# Altium project DC_Spannungsmessung.PrjPcb
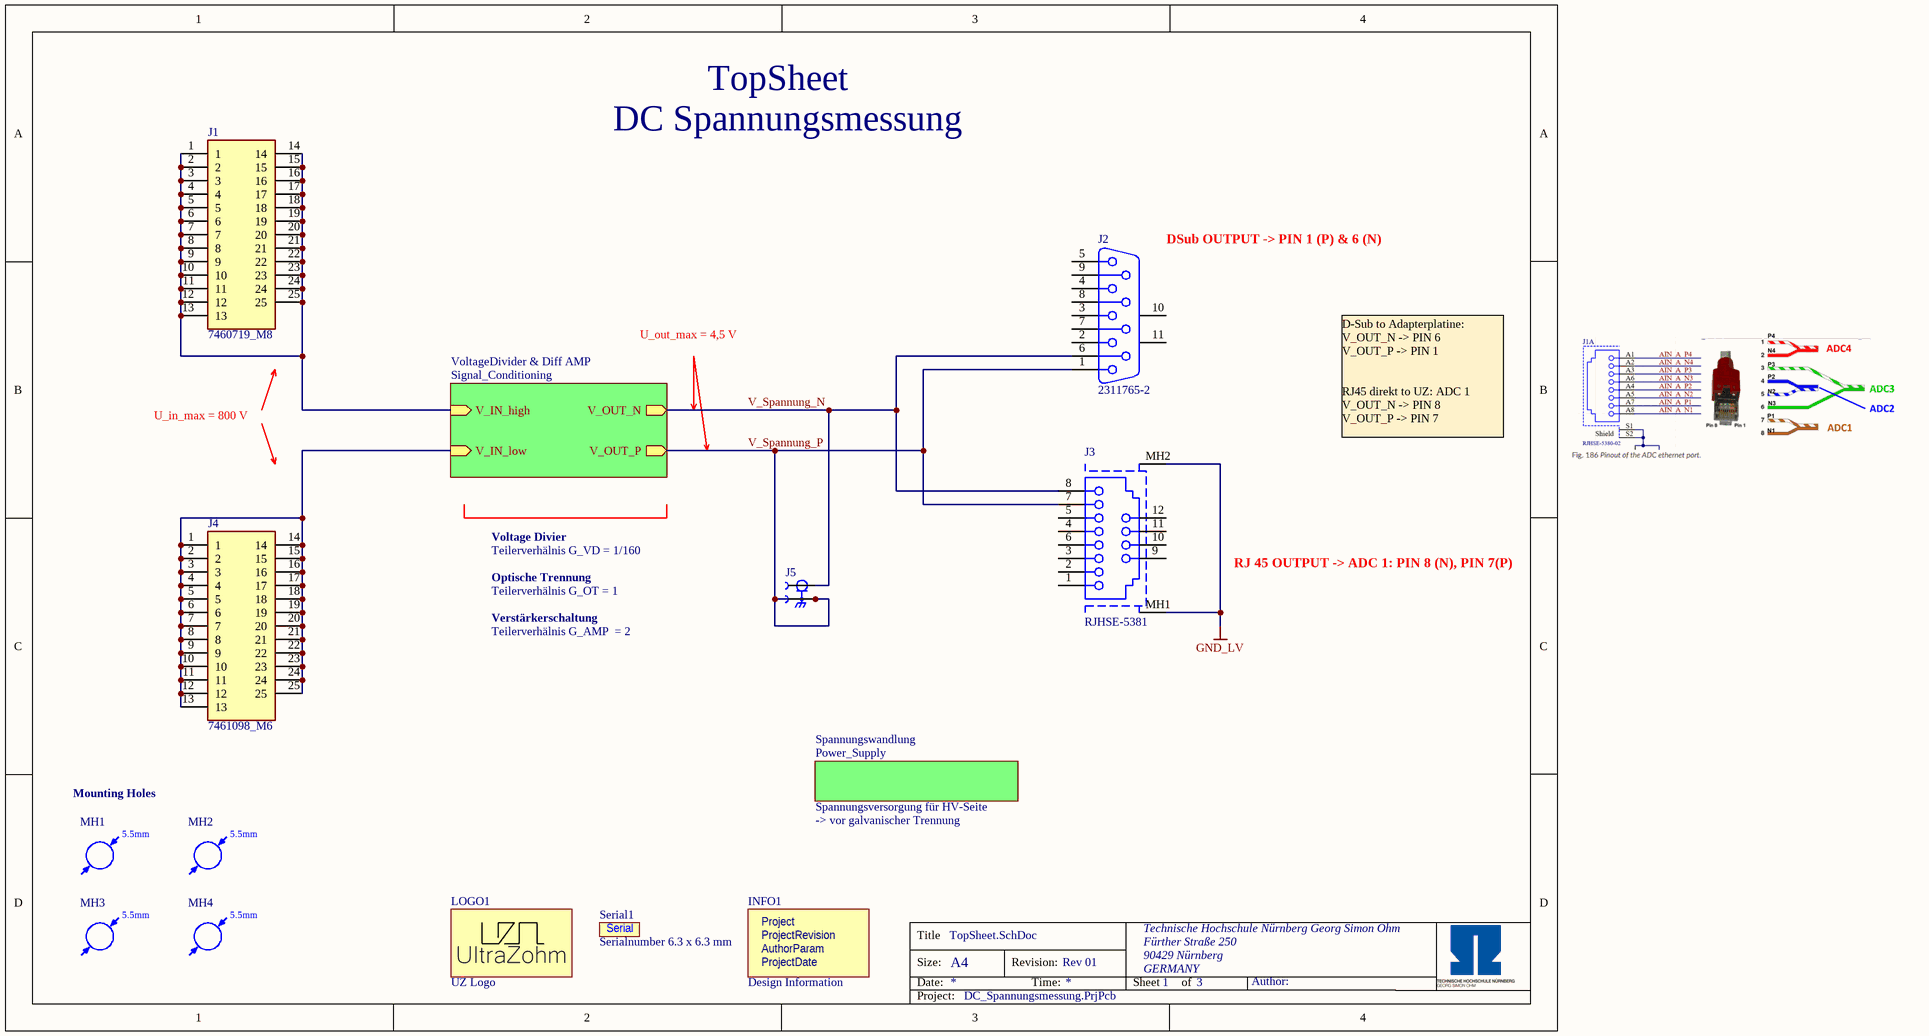
[diagram p0: TopSheet.SchDoc]
AuthorParam: T.Gaupp; Project: DC_Spannungsmessung; ProjectDate: 03/2024; ProjectRevision: Rev 01
3 sheets, 52 parts. Net scope: hierarchical (ports join the sheet entries above them; power ports are global).
Board file: PCB_DC_Spannungsmessung.PcbDoc
Sheets:
  TopSheet.SchDoc
    VoltageDivider & Diff AMP = Signal_Conditioning.SchDoc
  Power_Supply_HV.SchDoc

## Sheet TopSheet.SchDoc
size A4; Website: www.ultrazohm.com; Author: T.Gaupp; CompanyName: Technische Hochschule Nürnberg Georg Simon Ohm; Address1: Fürther Straße 250; Address2: 90429 Nürnberg; Address3: GERMANY; SheetNumber: 1; SheetTotal: 3; CompanyName2: Institut ELSYS

### Parts
INFO1  Design Information  [Design_info]  (no BOM)
J1  7460719_M8  [7460719]
J2  2311765-2  [2311765-2]
J3  RJHSE-5381  [RJHSE-5381]
J4  7461098_M6  [7461098]
J5  BNC5-J-P-GN-ST-TH2D_new  [BNC5-J-P-GN-ST-TH2D_new]  (value not drawn)
LOGO1  UZ Logo  [UZ_Logo_small]  (no BOM)
MH1  Mounting_Hole_M5  [Mounting Hole (M5)]  (value not drawn)
MH2  Mounting_Hole_M5  [Mounting Hole (M5)]  (value not drawn)
MH3  Mounting_Hole_M5  [Mounting Hole (M5)]  (value not drawn)
MH4  Mounting_Hole_M5  [Mounting Hole (M5)]  (value not drawn)
Serial1  Serialnumber 6.3 x 6.3 mm  [SERIAL_6.3X6.3MM]  (no BOM)

### Sub-sheets
Spannungswandlung = Power_Supply (file not in this document): no entries
VoltageDivider & Diff AMP = Signal_Conditioning: V_IN_high (in), V_IN_low (in), V_OUT_N (out), V_OUT_P (out)

### Nets
GND_HV: J4.1 J4.2 J4.3 J4.4 J4.5 J4.6 J4.7 J4.8 J4.9 J4.10 J4.11 J4.12 J4.13 J4.14 J4.15 J4.16 J4.17 J4.18 J4.19 J4.20 J4.21 J4.22 J4.23 J4.24 J4.25 ; sheet VoltageDivider & Diff AMP/V_IN_low
GND_LV: J3.MH1(Shell) J3.MH2(Shell)
V_Spannung_N: J2.6 J3.8 J5.1 ; sheet VoltageDivider & Diff AMP/V_OUT_N  [project net V_OUT_N]
V_Spannung_P: J2.1 J3.7 J5.S_1 J5.S_2 J5.S_3 ; sheet VoltageDivider & Diff AMP/V_OUT_P  [project net V_OUT_P]
NetJ1_1: J1.1 J1.2 J1.3 J1.4 J1.5 J1.6 J1.7 J1.8 J1.9 J1.10 J1.11 J1.12 J1.13 J1.14 J1.15 J1.16 J1.17 J1.18 J1.19 J1.20 J1.21 J1.22 J1.23 J1.24 J1.25 ; sheet VoltageDivider & Diff AMP/V_IN_high

Not connected (* = marked no-connect by the designer): J2 2 3 4 5 7 8 9 10(MH1) 11(MH2); J3 1 2 3 4 5 6 9(8) 10(8) 11(8) 12(8)

### Notes on the sheet
- TopSheet
- DC Spannungsmessung
- (near J2) DSub OUTPUT -> PIN 1 (P) & 6 (N)
- Type @ to refer to a designator or a net
- U_out_max = 4,5 V
- U_in_max = 800 V
- D-Sub to Adapterplatine:
  V_OUT_N -> PIN 6
  V_OUT_P -> PIN 1
  RJ45 direkt to UZ: ADC 1
  V_OUT_N -> PIN 8
  V_OUT_P -> PIN 7
- Voltage Divier
- Teilerverhälnis G_VD = 1/160
- Optische Trennung
- RJ 45 OUTPUT -> ADC 1: PIN 8 (N), PIN 7(P)
- Teilerverhälnis G_OT = 1
- Verstärkerschaltung
- Teilerverhälnis G_AMP  = 2
- Mounting Holes
- Spannungsversorgung für HV-Seite
- -> vor galvanischer Trennung
- Title
- Size:
- Date:
- A4
- Revision:
- Time:
- Sheet
- of
- Author:
- Project:
- (in symbol Design Information) Project; ProjectRevision; AuthorParam; ProjectDate
- (in symbol Mounting_Hole_M5) 5.5mm
- (in symbol Serial Number) Serial

### Library data of the parts
INFO1 = Design Information: Design InformationS; Manufacturer: UltraZohm; Created from: MGremer; Manufacturer Part Number: Design Information; PartID: 12; Created On: 03.11.2021 09:04:23; ComponentLink1Description: https://docs.ultrazohm.com/; ComponentLink1URL: homepage; Component Type: Design Information; Last Updated: 03.11.2021 09:28:34; Supplier 1: -; Supplier Part Number 1: -; Type: Design Information; Value: Design Information; Live Cycle Status: 1
J1 = 7460719_M8: Connector; Manufacturer_Name: Wurth Elektronik; Datasheet Link: https://www.mouser.com/datasheet/2/445/7460719-1723637.pdf; Height: 20.5mm; Manufacturer_Part_Number: 7460719; Mouser Part Number: 710-7460719; Mouser Price/Stock: https://www.mouser.co.uk/ProductDetail/Wurth-Elektronik/7460719?qs=lykWx4dhCCHoCGzpKhOnqA%3D%3D; Supplier 1: Mouser; Supplier Part Number 1: 710-7460719
J2 = 2311765-2: Connector D-Sub 9 Pin Female
J3 = RJHSE-5381: Connector Ethernet R/A RJ45 SHIELDED 8 CONT Y/G LEDS
J4 = 7461098_M6: Connector; Manufacturer_Name: Wurth Elektronik; Datasheet Link: https://katalog.we-online.com/em/datasheet/7461098.pdf; Height: 15.5mm; Manufacturer_Part_Number: 7461098; Mouser Part Number: 710-7461098; Mouser Price/Stock: https://www.mouser.co.uk/ProductDetail/Wurth-Elektronik/7461098?qs=lykWx4dhCCGHHs7z4oM%2FDg%3D%3D
J5 = BNC5-J-P-GN-ST-TH2D_new: BNC Connector; Supplier 1: Mouser; Supplier Part Number 1: 200-BNC5JPGNSTTH2D
LOGO1 = Logo small: Manufacturer: UltraZohm; Created from: MGremer; Created: Jan2021_Liegmann; Value: Logo; Manufacturer Part Number: Logo small; PartID: 10; Created On: 03.11.2021 09:04:23; ComponentLink1Description: https://docs.ultrazohm.com/; ComponentLink1URL: homepage; Component Type: Logo; Last Updated: 03.11.2021 09:05:50; Supplier 1: -; Supplier Part Number 1: -; Type: Logo; Live Cycle Status: 1
MH1-MH4 = Mounting_Hole_M5: Mounting Hole
Serial1 = Serial Number: Manufacturer: UltraZohm; Value: REV; Created from: MGremer; Created: 2018_09_18_AGeiger; Manufacturer Part Number: Serial Number; PartID: 11; Created On: 03.11.2021 09:04:23; ComponentLink1Description: https://docs.ultrazohm.com/; ComponentLink1URL: homepage; Component Type: Serial Number; Last Updated: 03.11.2021 09:28:34; Supplier 1: -; Supplier Part Number 1: -; Type: Serial Number; Live Cycle Status: 1

## Sheet Signal_Conditioning.SchDoc
size A4; Website: www.ultrazohm.com; Author: T.Gaupp; CompanyName: Technische Hochschule Nürnberg Georg Simon Ohm; Address1: Fürther Straße 250; Address2: 90429 Nürnberg; Address3: GERMANY; SheetNumber: 2; SheetTotal: 3; CompanyName2: Institut ELSYS
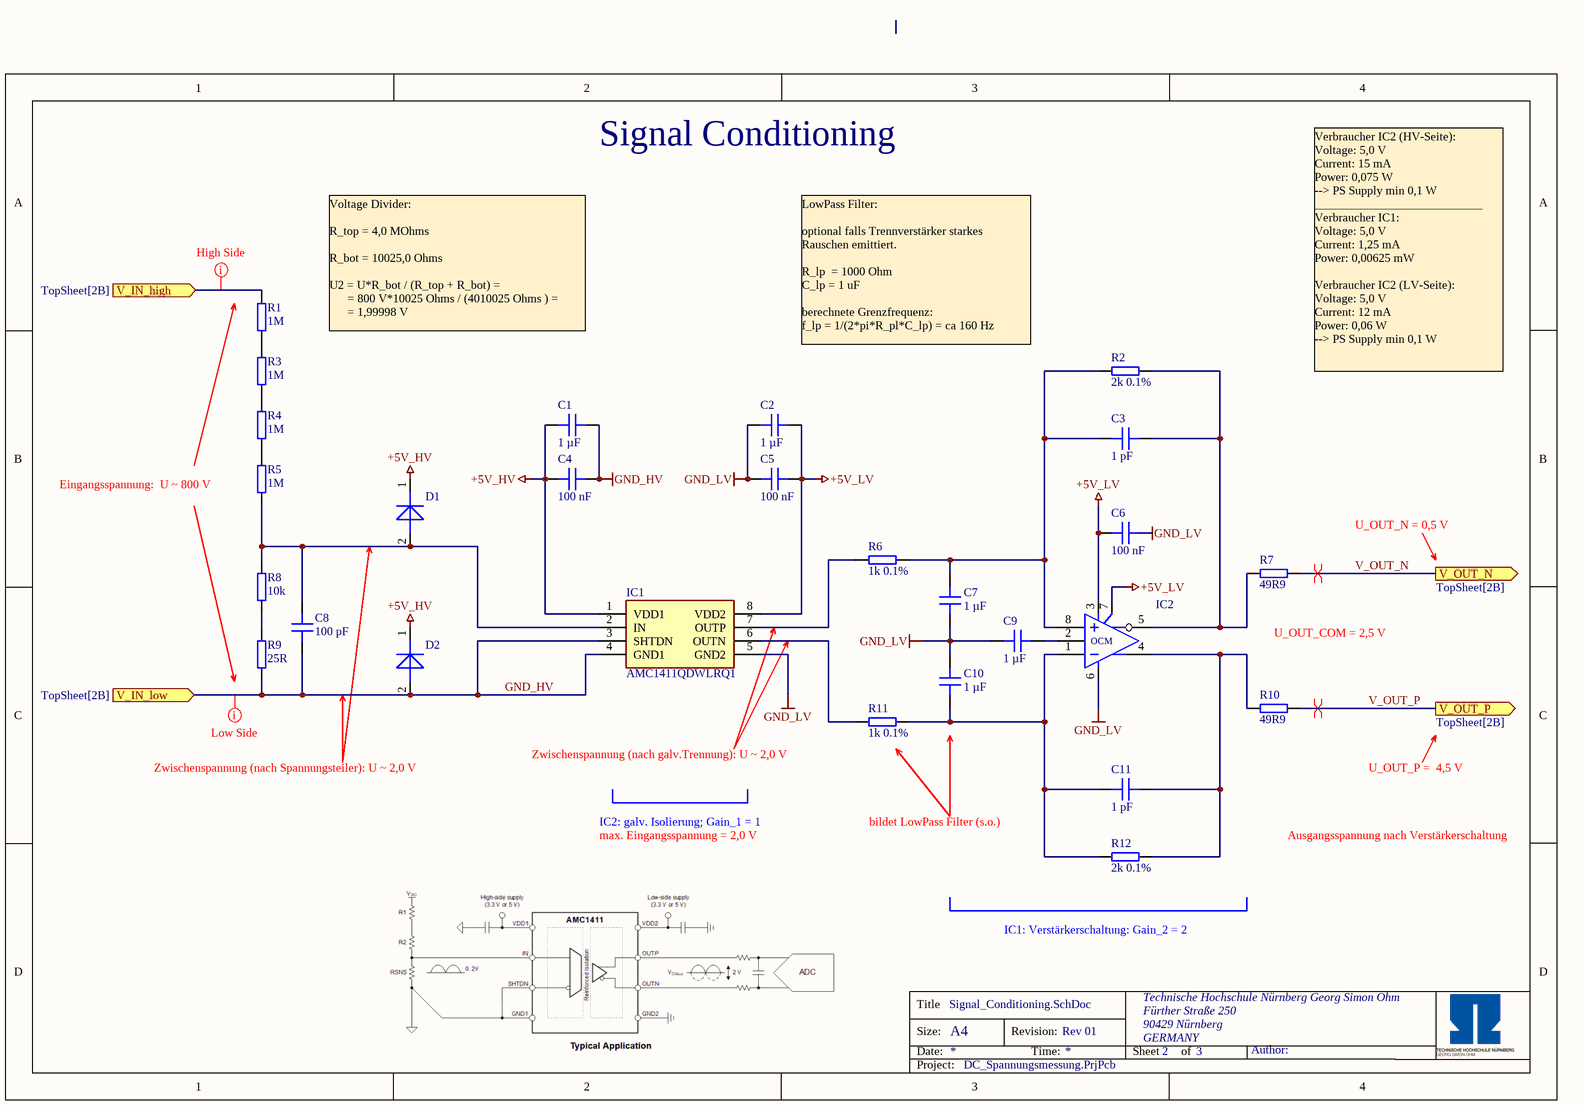
[diagram p1: Signal_Conditioning.SchDoc]

### Parts
(Parts that share a designator on the sheet are numbered #1, #2 ... from top to bottom, then left to right.)
C1  1 µF  [C_0603]
C2  1 µF  [C_0603]
C3  1 pF  [C_0603]
C4#1  100 nF  [C_0603]
C5  100 nF  [C_0603]
C6  100 nF  [C_0603]
C7#1  1 µF  [C_0603]
C8  100 pF  [C_0603]
C9  1 µF  [C_0603]
C10#1  1 µF  [C_0603]
C11#1  1 pF  [C_0603]
D1  1SS356VMFHTE-17  [1SS356VMFHTE17]  (value not drawn)
D2  1SS356VMFHTE-17  [1SS356VMFHTE17]  (value not drawn)
IC1  AMC1411QDWLRQ1  [SOIC127P1725X403-8N]
IC2  ADA4940-1ARZ-R7  [SOIC-8-N]  (value not drawn)
R1  1M  [RES 1206_3216]
R2  2k 0.1%  [RES 1206_3216]
R3  1M  [RES 1206_3216]
R4  1M  [RES 1206_3216]
R5  1M  [RES 1206_3216]
R6  1k 0.1%  [RES 1206_3216]
R7  49R9  [RES 0603_1608]
R8  10k  [RES 1206_3216]
R9  25R  [RES 0603_1608]
R10  49R9  [RES 0603_1608]
R11  1k 0.1%  [RES 1206_3216]
R12  2k 0.1%  [RES 1206_3216]

### Ports
V_IN_high (in, see TopSheet[2B]), V_IN_low (in, see TopSheet[2B]), V_OUT_N (out, see TopSheet[2B]), V_OUT_P (out, see TopSheet[2B])

### Nets
+5V_HV: C1.1 C4#1.1 D1.1(K) D2.1(K) IC1.1(VDD1)
+5V_LV: C2.2 C5.2 C6.1 IC1.8(VDD2) IC2.3(V+) IC2.7(EN)
GND_HV: C1.2 C4#1.2 C8.1 D2.2(A) IC1.3(SHTDN) IC1.4(GND1) R9.1 ; port V_IN_low
GND_LV: C2.1 C5.1 C6.2 C7#1.1 C9.1 C10#1.2 IC1.5(GND2) IC2.6(V-)
V_OUT_N: R7.2 ; port V_OUT_N
V_OUT_P: R10.2 ; port V_OUT_P
NetC3_1: C3.1 C7#1.2 IC2.8(+) R2.1 R6.2
NetC3_2: C3.2 IC2.5(Out) R2.2 R7.1
NetC8_2: C8.2 D1.2(A) IC1.2(IN) R5.1 R8.2
NetC9_2: C9.2 IC2.2(OCM)
NetC10#1_1: C10#1.1 C11#1.1 IC2.1(-) R11.2 R12.1
NetC11#1_2: C11#1.2 IC2.4(Out) R10.1 R12.2
NetIC1_6: IC1.6(OUTN) R11.1
NetIC1_7: IC1.7(OUTP) R6.1
NetJ1_1: R1.2 ; port V_IN_high
NetR1_1: R1.1 R3.2
NetR3_1: R3.1 R4.2
NetR4_1: R4.1 R5.2
NetR8_1: R8.1 R9.2

### Layout directives
differential pair: V_OUT_N, V_OUT_P
mark named Low Side: GND_HV
mark named High Side: NetJ1_1

### Notes on the sheet
- Signal Conditioning
- Voltage Divider:
  R_top = 4,0 MOhms
  R_bot = 10025,0 Ohms
  U2 = U*R_bot / (R_top + R_bot) =
  = 800 V*10025 Ohms / (4010025 Ohms ) =
  = 1,99998 V
- LowPass Filter:
  optional falls Trennverstärker starkes Rauschen emittiert.
  R_lp  = 1000 Ohm
  C_lp = 1 uF
  berechnete Grenzfrequenz:
  f_lp = 1/(2*pi*R_pl*C_lp) = ca 160 Hz
- Verbraucher IC2 (HV-Seite):
  Voltage: 5,0 V
  Current: 15 mA
  Power: 0,075 W
  --> PS Supply min 0,1 W
  ____________________________
  Verbraucher IC1:
  Voltage: 5,0 V
  Current: 1,25 mA
  Power: 0,00625 mW
  Verbraucher IC2 (LV-Seite):
  Voltage: 5,0 V
  Current: 12 mA
  Power: 0,06 W
  --> PS Supply min 0,1 W
- Eingangsspannung:  U ~ 800 V
- U_OUT_N = 0,5 V
- U_OUT_COM = 2,5 V
- Zwischenspannung (nach Spannungsteiler): U ~ 2,0 V
- (near R11) Zwischenspannung (nach galv.Trennung): U ~ 2,0 V
- U_OUT_P =  4,5 V
- IC2: galv. Isolierung; Gain_1 = 1
- max. Eingangsspannung = 2,0 V
- bildet LowPass Filter (s.o.)
- Ausgangsspannung nach Verstärkerschaltung
- IC1: Verstärkerschaltung: Gain_2 = 2
- Title
- Size:
- Date:
- A4
- Revision:
- Time:
- Sheet
- of
- Author:
- Project:

### Library data of the parts
C1 C2 C7#1 C9 C10#1 = CL10A105KB8NNNC: 50V 1uF X5R ±10% 0603  Multilayer Ceramic Capacitors MLCC - SMD/SMT ROHS; Manufacturer: Samsung Electro-Mechanics; Voltage Rating: 50 VDC; Created from: MGremer; Manufacturer Part Number: CL10A105KB8NNNC; Value: 1 µF; PartID: 5; Created On: 20.12.2020 13:54:13; ComponentLink1Description: Datasheet; ComponentLink1URL: https://datasheet.lcsc.com/lcsc/1810261812_Samsung-Electro-Mechanics-CL10A105KB8NNNC_C15849.pdf; Component Type: Capacitor 0603; Device Package: 0603; Last Updated: 28.11.2022 17:23:01; Mounting Type: SMD; Operating Temperature: -55 - 85°C; Series: M; Type: Capacitor; Tolerance: 10 %; Live Cycle Status: 1; LCSC Part Number: C15849; Stock number: Labor SMD Container; Supplier 1: Mouser; Supplier Part Number 1: 187-CL10A105KB8NNNC
C3 C11#1 = KGM15ACG1H1R0BT: Multilayer Ceramic Capacitors MLCC - SMD/SMT 50V 1pF C0G 0603 +/-.1pF; Manufacturer: KYOCERA AVX; Tolerance: 10%; Voltage Rating: 50 VDC; Created from: TGaupp; Manufacturer Part Number: KGM15ACG1H1R0BT; PartID: 147; Created On: 13.02.2024 08:51:22; ComponentLink1Description: Datasheet; ComponentLink1URL: https://www.mouser.de/datasheet/2/40/C0GNP0_KGM-3216332.pdf; Component Type: Capacitor 0603; Device Package: 0603; Last Updated: 13.02.2024 08:51:22; Mounting Type: SMD; Operating Temperature: -55 to +125°C; Series: C0G; Supplier 1: Mouser; Supplier Part Number 1: 581-KGM15ACG1H1R0BT; Type: Capacitor; Value: 1 pF; Live Cycle Status: 1
C4#1 C5 C6 = C0603C104K9PACTU: Capacitor 0603, 6.3 VDC, 100 nF, X5R; Manufacturer: KEMET; Tolerance: 10 %; Voltage Rating: 6.3 VDC; Created from: MGremer; Manufacturer Part Number: C0603C104K9PACTU; PartID: 70; Created On: 20.12.2020 13:54:13; ComponentLink1Description: Datasheet; ComponentLink1URL: https://www.mouser.de/datasheet/2/212/KEM_C1006_X5R_SMD-1103249.pdf; Component Type: Capacitor 0603; Device Package: 0603; Last Updated: 20.01.2021 13:57:36; Mounting Type: SMD; Operating Temperature: -55 - 85°C; Series: SMD Comm X5R; Supplier 1: Mouser; Supplier Part Number 1: 80-C0603C104K9P; Type: Capacitor; Value: 100 nF; Live Cycle Status: 1; Stock number: not stored
C8 = 885012006057: Capacitor 0603, 50 VDC, 100 pF, C0G; Manufacturer: Wuerth Elektronik; Tolerance: 5 %; Voltage Rating: 50 VDC; Created from: MGremer; Manufacturer Part Number: 885012006057; PartID: 44; Created On: 20.12.2020 13:54:13; ComponentLink1Description: Datasheet; ComponentLink1URL: https://www.mouser.de/datasheet/2/445/885012006057-1727261.pdf; Component Type: Capacitor 0603; Device Package: 0603; Last Updated: 20.12.2020 16:24:16; Mounting Type: SMD; Operating Temperature: -55 - 125°C; Series: WCAP-CSGP; Supplier 1: Mouser; Supplier Part Number 1: 710-885012006057; Type: Capacitor; Value: 100 pF; Live Cycle Status: 1; Stock number: not stored
D1 D2 = 1SS356VMFHTE-17: Diode; Manufacturer_Name: ROHM Semiconductor; Datasheet Link: https://fscdn.rohm.com/en/products/databook/datasheet/discrete/diode/switching/1ss355vmfhte-17-e.pdf; Height: 0.9mm; Manufacturer_Part_Number: 1SS356VMFHTE-17; Mouser Part Number: 755-1SS356VMFHTE-17; Mouser Price/Stock: https://www.mouser.co.uk/ProductDetail/ROHM-Semiconductor/1SS356VMFHTE-17?qs=doiCPypUmgG12xHjyvfQdg%3D%3D; Supplier 1: Mouser; Supplier Part Number 1: 755-1SS356VMFHTE-17
IC1 = AMC1411QDWLRQ1: Integrated Circuit; Manufacturer_Name: Texas Instruments; Datasheet Link: https://www.ti.com/lit/ds/symlink/amc1411-q1.pdf?HQS=dis-mous-null-mousermode-dsf-pf-null-wwe&ts=1671451088275&ref_url=https%253A%252F%252Fwww.mouser.in%252F; Height: 4.034mm; Manufacturer_Part_Number: AMC1411QDWLRQ1; Mouser Part Number: 595-AMC1411QDWLRQ1; Mouser Price/Stock: https://www.mouser.co.uk/ProductDetail/Texas-Instruments/AMC1411QDWLRQ1?qs=Rp5uXu7WBW9VgWcI1l5sjg%3D%3D; Supplier 1: Mouser; Supplier Part Number 1: 595-AMC1411QDWLRQ1
IC2 = ADA4940-1ARZ-R7: Differential ADC Driver; Manufacturer: Analog Devices; Class I: Analog; Class II: Fully Differential ADC Drivers (-40-125°C); Best.-Nr.: Farnell 209-6178; Channels: 1; Created from: MGremer; Datasheet: DSO11449, Ver. Aug 2000; Last edited: 04.01.2007 10:14; Package Reference: SOIC-N-8; Manufacturer Part Number: ADA4940-1ARZ-R7; PartID: 3; Created On: 15.01.2021 12:16:53; ComponentLink1Description: Datasheet; ComponentLink1URL: https://www.mouser.de/datasheet/2/609/ADA4940-1_4940-2-878284.pdf; Component Type: ADC; Device Package: SOIC-8; Last Updated: 22.11.2021 15:19:18; Mounting Type: SMD; Operating Temperature: -40 - 105 °C; Supplier 1: Mouser; Supplier Part Number 1: 584-ADA4940-1ARZ-R7; Type: ADC; Resolution: -; Value: differential ADC driver; Live Cycle Status: 1; Stock number: not stored
R1 R3-R5 = RS73F2BTTD1004B: SMD resistor 1MOhms .1% 330mW 25PPM/C; Manufacturer: KOA Speer; Tolerance: 0.1%; Created from: TGaupp; Manufacturer Part Number: RS73F2BTTD1004B; PartID: 318; Created On: 30.01.2024 08:46:50; ComponentLink1Description: Datasheet; ComponentLink1URL: https://www.koaspeer.com/pdfs/RS73.pdf; Component Type: SMD resistor; Device Package: 1206; Last Updated: 30.01.2024 08:46:50; Mounting Type: SMD; Supplier 1: Mouser; Supplier Part Number 1: 660-RS73F2BTTD1004B; Type: Resistor; Value: 1M; Live Cycle Status: 1; Stock number: not stored
R2 R12 = TNPW12062K00BEEA: SMD resistor 2Kohms .1% 400mW 25ppm; Manufacturer: Vishay; Created from: TGaupp; Manufacturer Part Number: TNPW12062K00BEEA; PartID: 323; Created On: 12.02.2024 09:48:36; ComponentLink1Description: Datasheet; ComponentLink1URL: https://www.vishay.com/docs/28758/tnpw_e3.pdf; Component Type: SMD resistor; Device Package: 1206; Last Updated: 12.02.2024 09:48:36; Mounting Type: SMD; Supplier 1: Mouser; Supplier Part Number 1: 71-TNPW12062K00BEEA; Type: Resistor; Tolerance: 0.1%; Value: 2k; Live Cycle Status: 1; Stock number: not stored
R6 R11 = ERA-8AEB102V: SMD resistor 1/4W 1.0Kohm 0.1% 25ppm; Manufacturer: Panasonic; Created from: TGaupp; Manufacturer Part Number: ERA-8AEB102V; PartID: 292; Created On: 08.08.2023 13:03:51; ComponentLink1Description: Datasheet; ComponentLink1URL: https://www.mouser.de/datasheet/2/315/AOA0000C307-1149632.pdf; Component Type: SMD resistor; Device Package: 1206; Last Updated: 08.08.2023 13:03:51; Mounting Type: SMD; Supplier 1: Mouser; Supplier Part Number 1: 667-ERA-8AEB102V; Type: Resistor; Tolerance: 0.1%; Value: 1k; Live Cycle Status: 1; Stock number: not stored; LCSC Part Number: C2079586
R7 R10 = RC0603FR-0749R9L: 100mW Thick Film Resistors ±100ppm/℃ ±1% 49.9Ω 0603 Chip Resistor - Surface Mount ROHS; Manufacturer: YAGEO; Created from: AGeiger; Manufacturer Part Number: RC0603FR-0749R9L; PartID: 277; Created On: 14.06.2023 17:42:26; ComponentLink1Description: Datasheet; ComponentLink1URL: https://datasheet.lcsc.com/lcsc/2304140030_YAGEO-RC0603FR-0749R9L_C114625.pdf; Component Type: SMD resistor; Device Package: 0603; Last Updated: 14.06.2023 17:42:26; Mounting Type: SMD; Type: Resistor; Tolerance: 1%; Value: 49R9; Live Cycle Status: 1; LCSC Part Number: C114625; Supplier 1: Mouser; Supplier Part Number 1: 603-RC0402FR-0749R9L
R8 = RS73F2BTTD1002B: SMD resistor 10kOhms .1% 330mW 25PPM/C; Manufacturer: KOA Speer; Tolerance: 0.1%; Created from: TGaupp; Manufacturer Part Number: RS73F2BTTD1002B; PartID: 320; Created On: 30.01.2024 09:03:35; ComponentLink1Description: Datasheet; ComponentLink1URL: https://www.koaspeer.com/pdfs/RS73.pdf; Component Type: SMD resistor; Device Package: 1206; Last Updated: 30.01.2024 09:03:35; Mounting Type: SMD; Supplier 1: Mouser; Supplier Part Number 1: 660-RS73F2BTTD1002B; Type: Resistor; Value: 10k; Live Cycle Status: 1; Stock number: not stored
R9 = RT0603BRD0725R2L: SMD resistor 0.1%; Manufacturer: YAGEO; Value: 25R2; Created from: DHufnagel; Manufacturer Part Number: RT0603BRD0725R2L; PartID: 213; Created On: 14.12.2020 16:17:14; ComponentLink1Description: Datasheet; ComponentLink1URL: https://www.mouser.de/datasheet/2/447/PYu_RT_1_to_0_01_RoHS_L_11-1669912.pdf; Component Type: SMD resistor; Device Package: 0603; Last Updated: 02.03.2021 14:07:32; Mounting Type: SMD; Supplier 1: Mouser; Supplier Part Number 1: 603-RT0603BRD0725R2L; Type: Resistor; Tolerance: 0.1%; Live Cycle Status: 1; Stock number: not stored

## Sheet Power_Supply_HV.SchDoc
size A4; Author: T.Gaupp; CompanyName: Technische Hochschule Nürnberg Georg Simon Ohm; Address1: Fürther Straße 250; Address2: 90429 Nürnberg; Address3: GERMANY; SheetNumber: 3; SheetTotal: 3; CompanyName2: Institut ELSYS
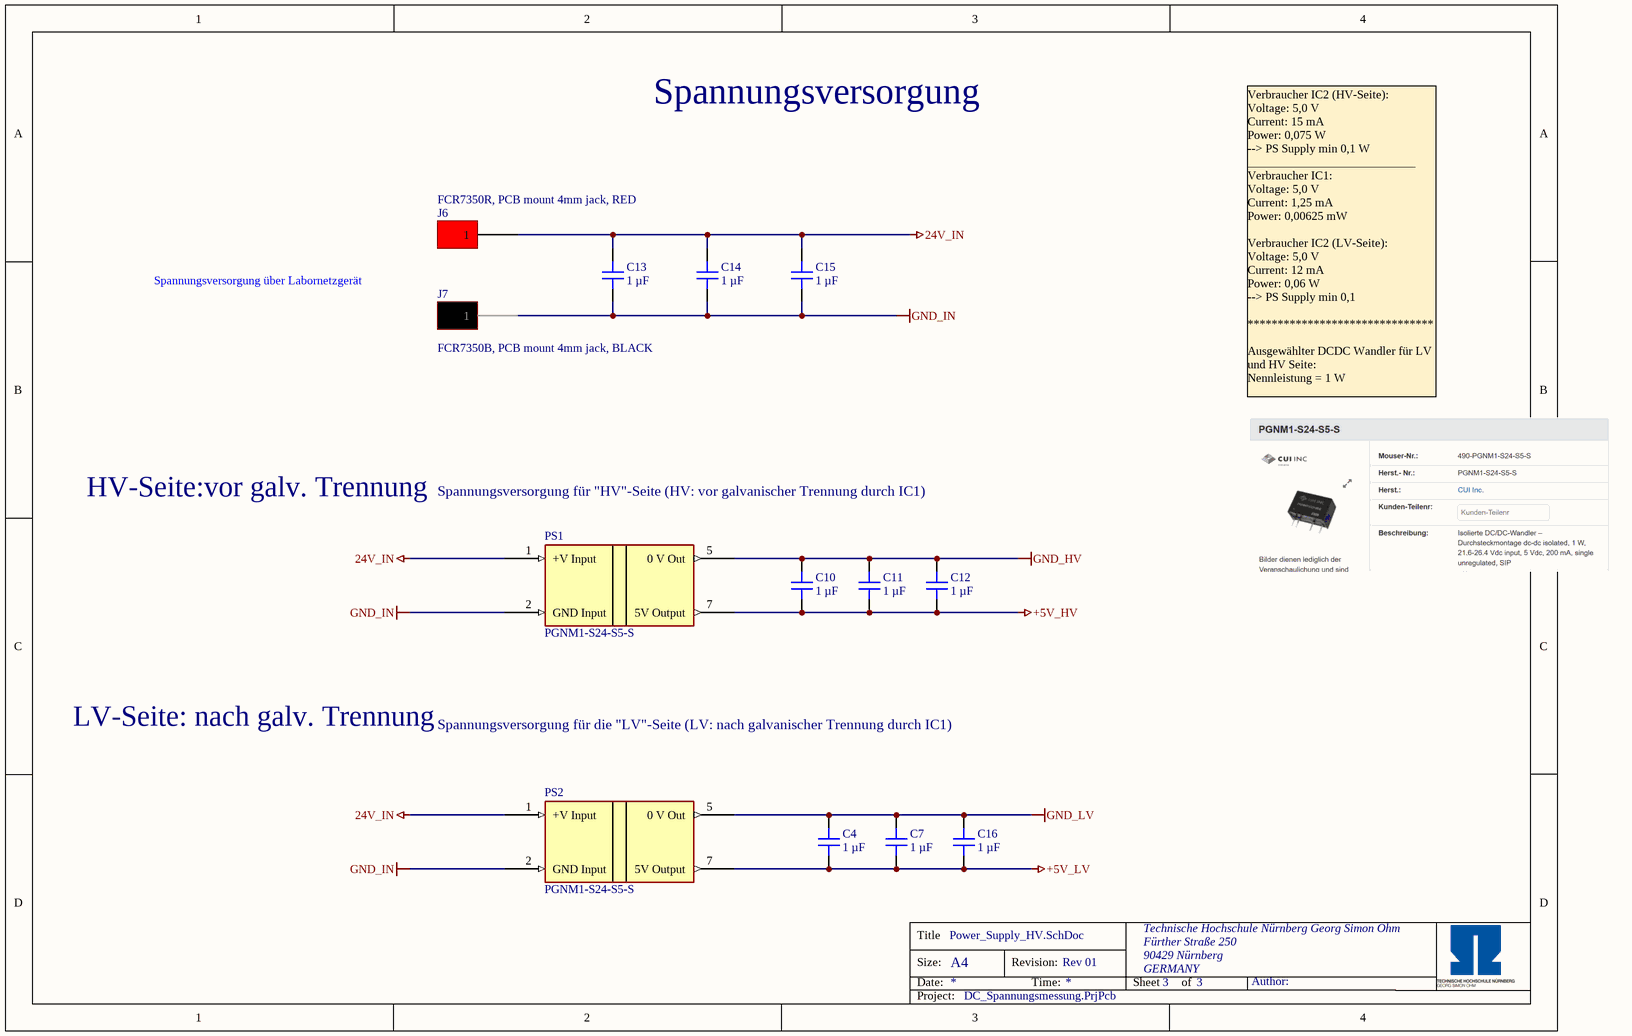
[diagram p2: Power_Supply_HV.SchDoc]

### Parts
(Parts that share a designator on the sheet are numbered #1, #2 ... from top to bottom, then left to right.)
C4#2  1 µF  [C_0603]
C7#2  1 µF  [C_0603]
C10#2  1 µF  [C_0603]
C11#2  1 µF  [C_0603]
C12  1 µF  [C_0603]
C13  1 µF  [C_0603]
C14  1 µF  [C_0603]
C15  1 µF  [C_0603]
C16  1 µF  [C_0603]
J6  FCR7350R, PCB mount 4mm jack, RED  [FCR7350]
J7  FCR7350B, PCB mount 4mm jack, BLACK  [FCR7350]
PS1  PGNM1-S24-S5-S  [PGNM1-S24-S5-S]
PS2  PGNM1-S24-S5-S  [PGNM1-S24-S5-S]

### Nets
24V_IN: C13.1 C14.1 C15.1 J6.1 PS1.1(+V_Input) PS2.1(+V_Input)
+5V_HV: C10#2.2 C11#2.2 C12.2 PS1.7(5V_Output)
+5V_LV: C4#2.1 C7#2.1 C16.1 PS2.7(5V_Output)
GND_HV: C10#2.1 C11#2.1 C12.1 PS1.5(0_V_Out)
GND_IN: C13.2 C14.2 C15.2 J7.1 PS1.2(GND_Input) PS2.2(GND_Input)
GND_LV: C4#2.2 C7#2.2 C16.2 PS2.5(0_V_Out)

### Notes on the sheet
- Spannungsversorgung
- Spannungsversorgung über Labornetzgerät
- Verbraucher IC2 (HV-Seite):
  Voltage: 5,0 V
  Current: 15 mA
  Power: 0,075 W
  --> PS Supply min 0,1 W
  ____________________________
  Verbraucher IC1:
  Voltage: 5,0 V
  Current: 1,25 mA
  Power: 0,00625 mW
  Verbraucher IC2 (LV-Seite):
  Voltage: 5,0 V
  Current: 12 mA
  Power: 0,06 W
  --> PS Supply min 0,1
  *******************************
  Ausgewählter DCDC Wandler für LV und HV Seite:
  Nennleistung = 1 W
- HV-Seite:vor galv. Trennung
- Spannungsversorgung für "HV"-Seite (HV: vor galvanischer Trennung durch IC1)
- LV-Seite: nach galv. Trennung
- Spannungsversorgung für die "LV"-Seite (LV: nach galvanischer Trennung durch IC1)
- Title
- Size:
- Date:
- A4
- Revision:
- Time:
- Sheet
- of
- Author:
- Project:

### Library data of the parts
C4#2 C7#2 C10#2 C11#2 C12-C16 = CL10A105KB8NNNC: as C1 on sheet Signal_Conditioning; Supplier 1: LCSC; Supplier Part Number 1: C15849; Manufacturer Part Number: CL10A105KB8NNNC; Value: 1 µF; PartID: 5; Created On: 20.12.2020 13:54:13; ComponentLink1Description: Datasheet; ComponentLink1URL: https://datasheet.lcsc.com/lcsc/1810261812_Samsung-Electro-Mechanics-CL10A105KB8NNNC_C15849.pdf; Component Type: Capacitor 0603; Device Package: 0603; Last Updated: 28.11.2022 17:23:01; Mounting Type: SMD; Operating Temperature: -55 - 85°C; Series: M; Type: Capacitor; Tolerance: 10 %; Live Cycle Status: 1; LCSC Part Number: C15849; Stock number: Labor SMD Container
J6 = FCR7350R: FCR7350B, 1000V, 24A, RED; Manufacturer: Cliff; Value: PCB mount 4mm jack, Red FCR7350R, 1000V, 24A; Created from: DHufnagel; Manufacturer Part Number: FCR7350R; PartID: 7; Created On: 13.06.2022 10:18:11; ComponentLink1Description: datasheet; ComponentLink1URL: https://www.cliffuk.co.uk/products/testleads/sockets/S16NPC.pdf; ComponentLink2Description: drawing; ComponentLink2URL: https://media.digikey.com/pdf/Data%20Sheets/Cliff%20Electronic%20LTD%20PDF's/FCR7350_Drawing.pdf; Component Type: PCB mount 4mm jack, Red; Device Package: THT; Last Updated: 28.06.2022 13:58:37; Minimum Order: 1; Mounting Type: THT; Operating Temperature: -40°C - 80°C; Series: S16N-PC; Supplier 1: Digi-Key; Supplier Part Number 1: 3185-FCR7350R-ND; Supplier 2: farnell; Supplier Part Number 2: 1854508; Type: PCB mount 4mm jack, Red FCR7350R, 1000V, 24A; Live Cycle Status: 1; Stock number: not stored
J7 = FCR7350B: FCR7350B, 1000V, 24A, BLACK; Manufacturer: Cliff; Value: PCB mount 4mm jack, Black	FCR7350B, 1000V, 24A; Created from: DHufnagel; Manufacturer Part Number: FCR7350B; PartID: 6; Created On: 13.06.2022 10:18:11; ComponentLink1Description: datasheet; ComponentLink1URL: https://www.cliffuk.co.uk/products/testleads/sockets/S16NPC.pdf; ComponentLink2Description: drawing; ComponentLink2URL: https://media.digikey.com/pdf/Data%20Sheets/Cliff%20Electronic%20LTD%20PDF's/FCR7350_Drawing.pdf; Component Type: PCB mount 4mm jack, Black; Device Package: THT; Last Updated: 28.06.2022 13:58:37; Minimum Order: 1; Mounting Type: THT; Operating Temperature: -40°C - 80°C; Series: S16N-PC; Supplier 1: Digi-Key; Supplier Part Number 1: 3185-FCR7350B-ND; Supplier 2: farnell; Supplier Part Number 2: 1854507; Type: PCB mount 4mm jack, Black	FCR7350B, 1000V, 24A; Live Cycle Status: 1; Stock number: not stored
PS1 PS2 = PGNM1-S24-S5-S: Isolierte DC/DC-Wandler – Durchsteckmontage dc-dc isolated, 1 W, 21.6-26.4 Vdc input, 5 Vdc, 200 mA, single unregulated, SIP; Parameter 1: *; Supplier 1: Mouser; Supplier Part Number 1: 490-PGNM1-S24-S5-S

## Nets that join several sheets
+5V_HV: Signal_Conditioning (5 pins), Power_Supply_HV (C10#2.2 C11#2.2 C12.2 PS1.7)
+5V_LV: Signal_Conditioning (6 pins), Power_Supply_HV (C4#2.1 C7#2.1 C16.1 PS2.7)
GND_HV: TopSheet (25 pins), Signal_Conditioning (7 pins), Power_Supply_HV (C10#2.1 C11#2.1 C12.1 PS1.5)
GND_LV: TopSheet (J3.MH1 J3.MH2), Signal_Conditioning (8 pins), Power_Supply_HV (C4#2.2 C7#2.2 C16.2 PS2.5)
NetJ1_1: TopSheet (25 pins), Signal_Conditioning (R1.2)
V_OUT_N: TopSheet (J2.6 J3.8 J5.1), Signal_Conditioning (R7.2)
V_OUT_P: TopSheet (5 pins), Signal_Conditioning (R10.2)